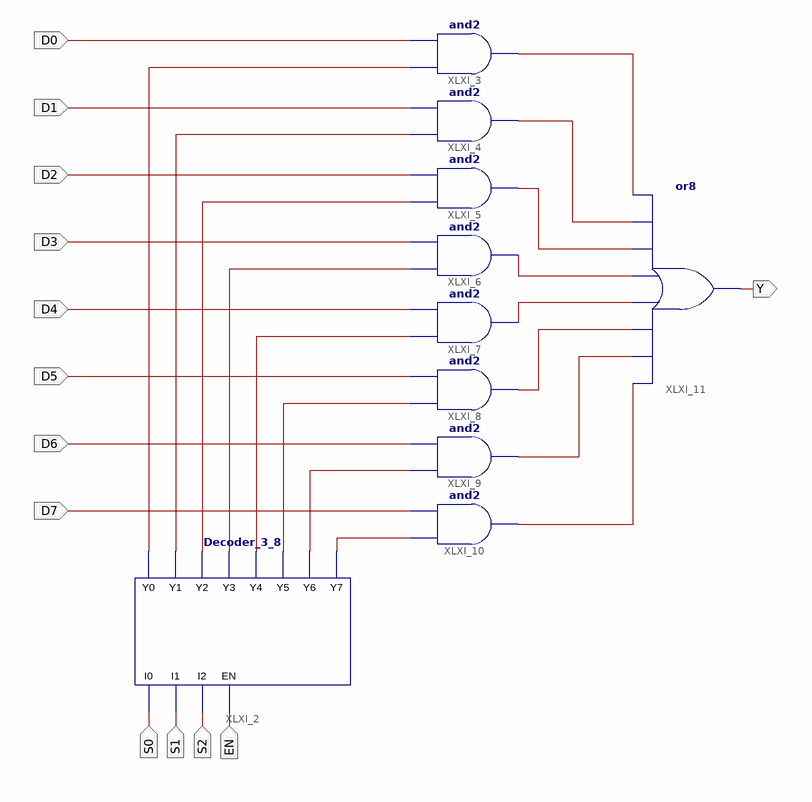
[diagram p0: schematic sheet 1]
// Xilinx ISE schematic Mux_to_1.sch (spartan3e) as structural Verilog: 10 symbols, 13 ports
module Mux_to_1 (
  input  D0,
  input  D1,
  input  D2,
  input  D3,
  input  D4,
  input  D5,
  input  D6,
  input  D7,
  input  S0,
  input  S1,
  input  S2,
  input  EN,
  output Y
);

  wire XLXN_3, XLXN_4, XLXN_5, XLXN_6, XLXN_7, XLXN_8, XLXN_9, XLXN_10, XLXN_21, XLXN_22, XLXN_23, XLXN_24,
       XLXN_25, XLXN_26, XLXN_27, XLXN_28;

  and XLXI_3 (XLXN_21, XLXN_3, D0);
  and XLXI_4 (XLXN_22, XLXN_4, D1);
  and XLXI_5 (XLXN_23, XLXN_5, D2);
  and XLXI_6 (XLXN_24, XLXN_6, D3);
  and XLXI_7 (XLXN_25, XLXN_7, D4);
  and XLXI_8 (XLXN_26, XLXN_8, D5);
  and XLXI_9 (XLXN_27, XLXN_9, D6);
  and XLXI_10 (XLXN_28, XLXN_10, D7);
  Decoder_3_8 XLXI_2 (
    .EN(EN), .I0(S0), .I1(S1), .I2(S2), .Y0(XLXN_3), .Y1(XLXN_4), .Y2(XLXN_5), .Y3(XLXN_6), .Y4(XLXN_7),
    .Y5(XLXN_8), .Y6(XLXN_9), .Y7(XLXN_10));
  or XLXI_11 (Y, XLXN_28, XLXN_27, XLXN_26, XLXN_25, XLXN_24, XLXN_23, XLXN_22, XLXN_21);
endmodule
